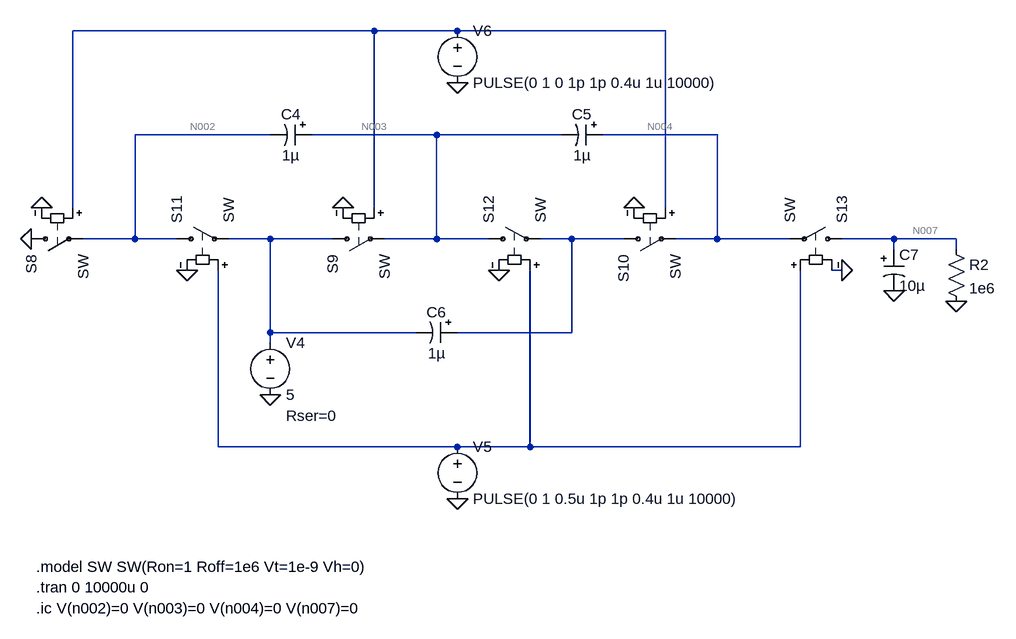
[diagram p0: schematic LD.asc]
LD.asc, the LTspice schematic file:
Version 4
SHEET 1 2028 1468
WIRE 336 560 -128 560
WIRE 464 560 336 560
WIRE 784 560 464 560
WIRE 176 720 -32 720
WIRE 432 720 240 720
WIRE 624 720 432 720
WIRE 864 720 688 720
WIRE -128 832 -128 560
WIRE 336 832 336 560
WIRE 784 832 784 560
WIRE -32 880 -32 720
WIRE -32 880 -112 880
WIRE 32 880 -32 880
WIRE 176 880 112 880
WIRE 272 880 176 880
WIRE 432 880 432 720
WIRE 432 880 352 880
WIRE 512 880 432 880
WIRE 640 880 592 880
WIRE 720 880 640 880
WIRE 864 880 864 720
WIRE 864 880 800 880
WIRE 976 880 864 880
WIRE 1136 880 1056 880
WIRE 1232 880 1136 880
WIRE 1136 896 1136 880
WIRE 1232 896 1232 880
WIRE 1056 928 1040 928
WIRE 176 1024 176 880
WIRE 400 1024 176 1024
WIRE 640 1024 640 880
WIRE 640 1024 464 1024
WIRE 176 1040 176 1024
WIRE 96 1200 96 928
WIRE 464 1200 96 1200
WIRE 576 1200 576 928
WIRE 576 1200 464 1200
WIRE 992 1200 992 928
WIRE 992 1200 576 1200
FLAG -176 832 0
FLAG 48 928 0
FLAG 288 832 0
FLAG 528 928 0
FLAG 736 832 0
FLAG 176 1120 0
FLAG 1056 928 0
FLAG -192 880 0
FLAG 1136 960 0
FLAG 1232 976 0
FLAG 464 1280 0
FLAG 464 640 0
SYMBOL sw -208 880 M90
SYMATTR InstName S8
SYMBOL sw 256 880 M90
SYMATTR InstName S9
SYMBOL sw 704 880 M90
SYMATTR InstName S10
SYMBOL sw 16 880 R270
SYMATTR InstName S11
SYMBOL sw 496 880 R270
SYMATTR InstName S12
SYMBOL sw 1072 880 M270
SYMATTR InstName S13
SYMBOL voltage 176 1024 R0
WINDOW 123 0 0 Left 2
WINDOW 39 24 128 Left 2
SYMATTR SpiceLine Rser=0
SYMATTR InstName V4
SYMATTR Value 5
SYMBOL polcap 240 704 R90
WINDOW 0 0 32 VBottom 2
WINDOW 3 32 32 VTop 2
SYMATTR InstName C4
SYMATTR Value 1µ
SYMBOL polcap 688 704 R90
WINDOW 0 0 32 VBottom 2
WINDOW 3 32 32 VTop 2
SYMATTR InstName C5
SYMATTR Value 1µ
SYMBOL polcap 464 1008 R90
WINDOW 0 0 32 VBottom 2
WINDOW 3 32 32 VTop 2
SYMATTR InstName C6
SYMATTR Value 1µ
SYMBOL polcap 1120 896 R0
SYMATTR InstName C7
SYMATTR Value 10µ
SYMBOL res 1216 880 R0
SYMATTR InstName R2
SYMATTR Value 1e6
SYMBOL voltage 464 1184 R0
WINDOW 123 0 0 Left 2
WINDOW 39 0 0 Left 2
SYMATTR InstName V5
SYMATTR Value PULSE(0 1 0.5u 1p 1p 0.4u 1u 10000)
SYMBOL voltage 464 544 R0
WINDOW 123 0 0 Left 2
WINDOW 39 0 0 Left 2
SYMATTR InstName V6
SYMATTR Value PULSE(0 1 0 1p 1p 0.4u 1u 10000)
TEXT -184 1384 Left 2 !.model SW SW(Ron=1 Roff=1e6 Vt=1e-9 Vh=0)
TEXT -184 1416 Left 2 !.tran 0 10000u 0
TEXT -184 1448 Left 2 !.ic V(n002)=0 V(n003)=0 V(n004)=0 V(n007)=0

The netlist it stands for:
* LD.asc
S8 0 N002 N001 0 SW
S9 N005 N003 N001 0 SW
S10 N006 N004 N001 0 SW
S11 N002 N005 N008 0 SW
S12 N003 N006 N008 0 SW
S13 N007 N004 N008 0 SW
V4 N005 0 5 Rser=0
C4 N003 N002 1µ
C5 N004 N003 1µ
C6 N006 N005 1µ
C7 N007 0 10µ
R2 N007 0 1e6
V5 N008 0 PULSE(0 1 0.5u 1p 1p 0.4u 1u 10000)
V6 N001 0 PULSE(0 1 0 1p 1p 0.4u 1u 10000)
.model SW SW(Ron=1 Roff=1e6 Vt=1e-9 Vh=0)
.tran 0 10000u 0
.ic V(n002)=0 V(n003)=0 V(n004)=0 V(n007)=0
.backanno
.end